# EAGLE design Control_board (EAGLE 8.6.3)
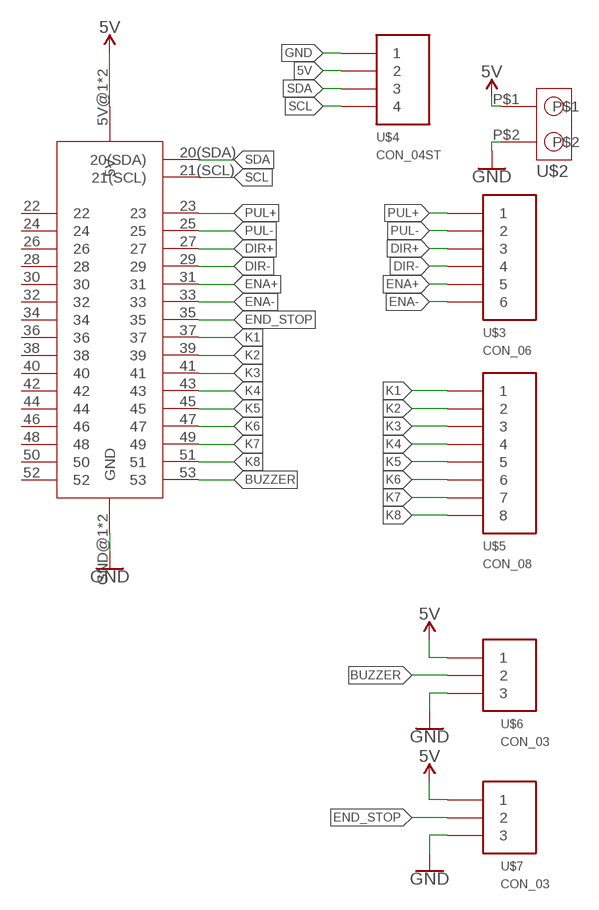
[diagram p0: schematic, sheet 1]

## Parts
U$1  ARDUINO_MEGA_SHIELD  [ARDUINO_MEGA_SHIELD]
U$2  SCREW_TERMINAL-2P  [SCREW_TERMINAL-2P]
U$3  CON_06  [6-PIN]
U$4  CON_04ST  [4-PIN]
U$5  CON_08  [8-PIN]
U$6  CON_03  [3-PIN]
U$7  CON_03  [3-PIN]

## Nets
5V: U$1.5V@1(5V) U$1.5V@2(5V) U$2.P$1 U$4.3 U$6.3 U$7.3
BUZZER: U$1.53 U$6.2
DIR+: U$1.27 U$3.3
DIR-: U$1.29 U$3.4
ENA+: U$1.31 U$3.5
ENA-: U$1.33 U$3.6
END_STOP: U$1.35 U$7.2
GND: U$1.GND@1(GND) U$1.GND@2(GND) U$2.P$2 U$4.4 U$6.1 U$7.1
K1: U$1.37 U$5.1
K2: U$1.39 U$5.2
K3: U$1.41 U$5.3
K4: U$1.43 U$5.4
K5: U$1.45 U$5.5
K6: U$1.47 U$5.6
K7: U$1.49 U$5.7
K8: U$1.51 U$5.8
PUL+: U$1.23 U$3.1
PUL-: U$1.25 U$3.2
SCL: U$1.21(SCL) U$4.1
SDA: U$1.20(SDA) U$4.2
Unconnected: U$1.22 U$1.24 U$1.26 U$1.28 U$1.30 U$1.32 U$1.34 U$1.36 U$1.38 U$1.40 U$1.42 U$1.44 U$1.46 U$1.48 U$1.50 U$1.52

## Library data of the parts
U$1 = ICD_stripper:ARDUINO_MEGA_SHIELD
U$2 = ICD_stripper:SCREW_TERMINAL-2P
U$3 = con2001_M'Lab_design_criteria:CON_06
U$4 = con2001_M'Lab_design_criteria:CON_04
U$5 = con2001_M'Lab_design_criteria:CON_08
U$6 U$7 = con2001_M'Lab_design_criteria:CON_03

## Board
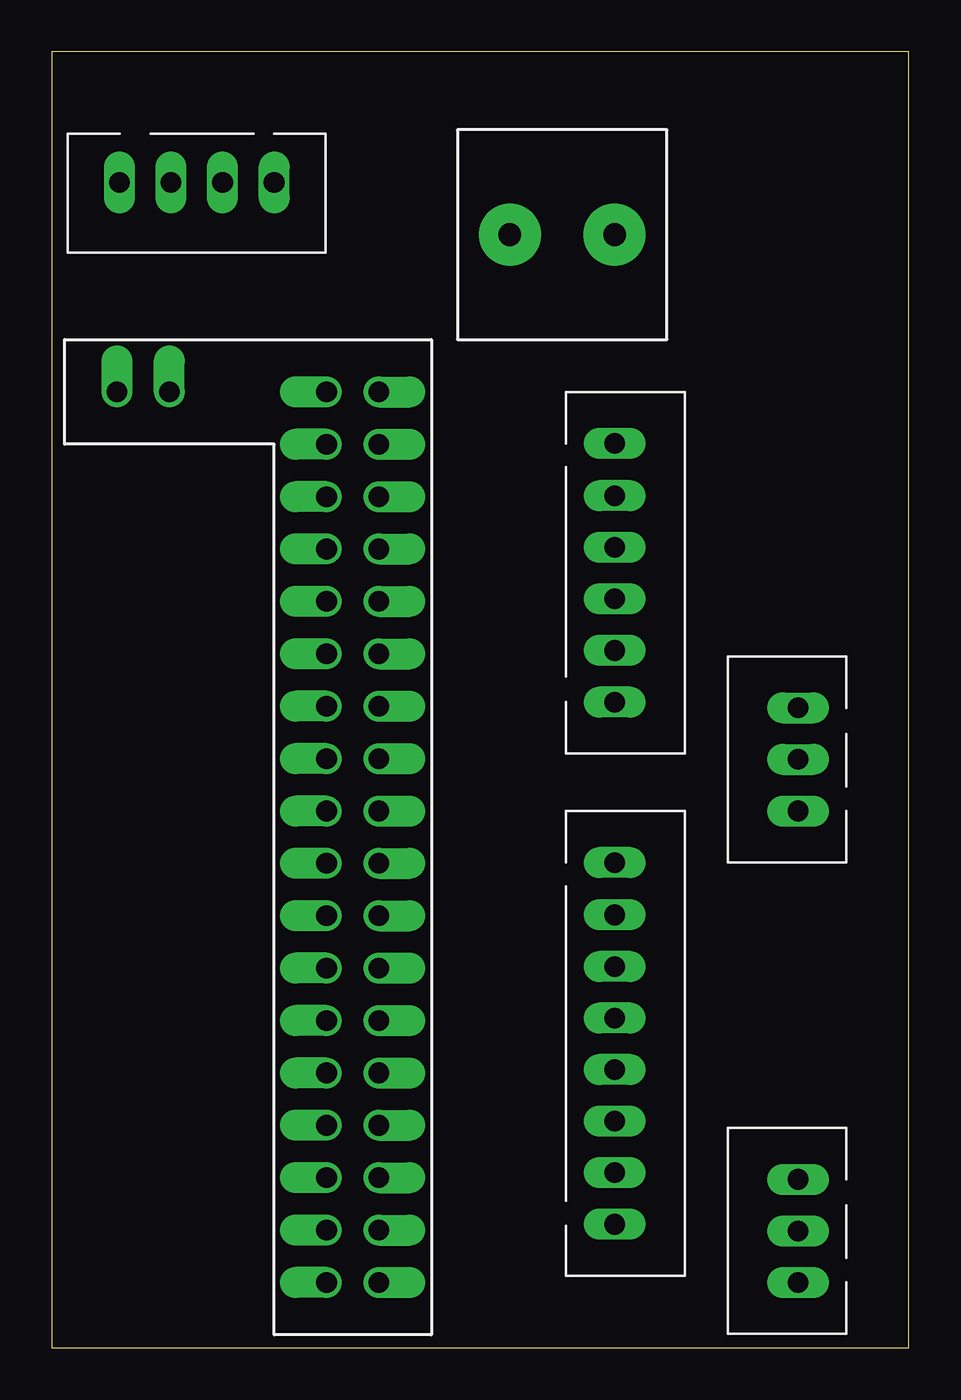
[diagram p1: board, top side]
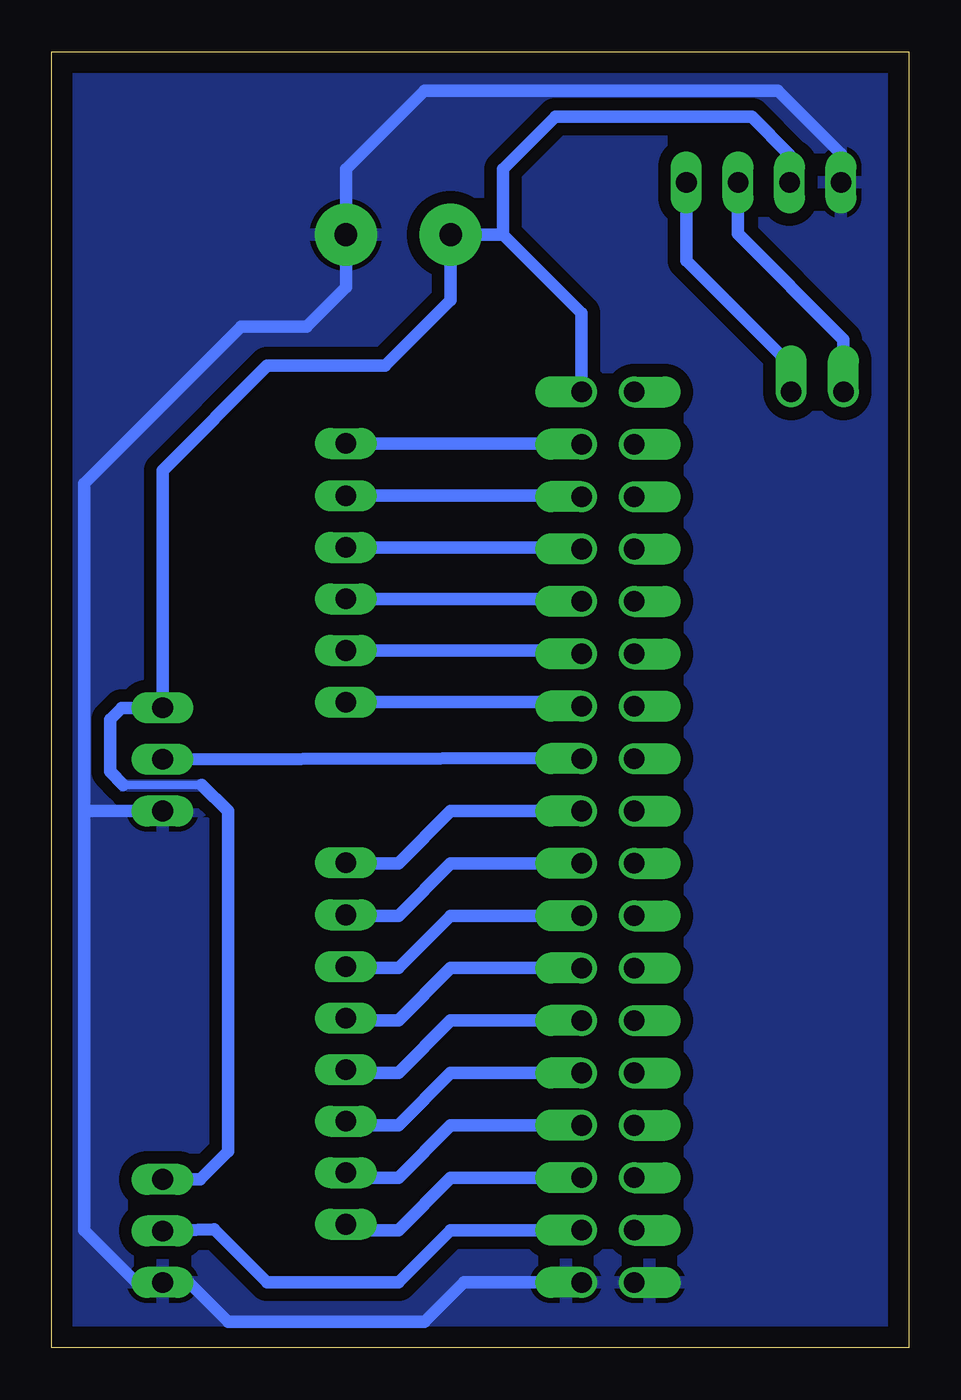
[diagram p2: board, bottom side, seen from below]

Size 41.58 x 62.85 mm. Coordinates in mm from the lower left corner, seen from the top.
Outline: 0,0 41.58,0 41.58,62.85 0,62.85 0,0
Copper layers (1*16): Top 0.035mm / dielectric 1.5mm / Bottom 0.035mm
Design rules "default": minimum track width 6mil, minimum drill 0.35mm, track to track 6mil, track to pad 6mil, pad to pad 6mil, via to via 6mil, smd to smd 6mil, copper to edge 40mil, drill to drill 6mil, minimum pad ring 10mil, minimum via ring 8mil, stop-mask expansion 4mil, vias tented up to drill 0mil, thermal gap 10mil
bRestrict: 2 lines

### Footprints (pad centres in the part's own frame; a part is rotated, then mirrored left to right if it is on the bottom)
ARDUINO_MEGA_SHIELD = drill 1 offset: 5V@1 -2.54,0; 5V@2 0,0; 20(SDA) -12.7,0; 21(SCL) -10.16,0; 22 -2.54,-2.54; 23 0,-2.54; 24 -2.54,-5.08; 25 0,-5.08; 26 -2.54,-7.62; 27 0,-7.62; 28 -2.54,-10.16; 29 0,-10.16; 30 -2.54,-12.7; 31 0,-12.7; 32 -2.54,-15.24; 33 0,-15.24; 34 -2.54,-17.78; 35 0,-17.78; 36 -2.54,-20.32; 37 0,-20.32; 38 -2.54,-22.86; 39 0,-22.86; 40 -2.54,-25.4; 41 0,-25.4; 42 -2.54,-27.94; 43 0,-27.94; 44 -2.54,-30.48; 45 0,-30.48; 46 -2.54,-33.02; 47 0,-33.02; 48 -2.54,-35.56; 49 0,-35.56; 50 -2.54,-38.1; 51 0,-38.1; 52 -2.54,-40.64; 53 0,-40.64; GND@1 -2.54,-43.18; GND@2 0,-43.18
SCREW_TERMINAL-2P = drill 1.1 pad 3: P$1 0,0; P$2 0,-5.08
6-PIN = drill 1 long: 1 -0.04,0; 2 2.5,0; 3 5,0; 4 7.5,0; 5 10,0; 6 12.5,0
4-PIN = drill 1 long: 1 0,0; 2 2.5,0; 3 5,0; 4 7.5,0
8-PIN = drill 1 long: 1 -0.04,0; 2 2.5,0; 3 5,0; 4 7.5,0; 5 10,0; 6 12.5,0; 7 15,0; 8 17.5,0
3-PIN = drill 1 long: 1 0,0; 2 2.5,0; 3 5,0

### Placement (x,y rotation side)
U$1  15.88,46.35 0 top
U$2  22.23,53.98 90 top
U$3  27.3,43.81 270 top
U$4  10.79,56.52 180 top
U$5  27.3,23.5 270 top
U$6  36.2,3.17 90 top
U$7  36.2,26.04 90 top

### Tracks (layer width: path | path; a pad name or v marks a point on that pad's centre or on a via)
5V
  Bottom 0.406: 38.1,27.3 34.29,27.3
  Bottom 0.61: 19.68,53.98 U$2.P$1 22.23,50.8 25.4,47.62 31.11,47.62 36.2,42.55 U$7.3 38.18,31.04 38.73,30.48 38.73,27.94 38.1,27.3 | 19.68,53.98 15.88,50.16 U$1.5V@2 | U$4.3 5.79,57.87 7.62,59.69 17.14,59.69 19.68,57.15 19.68,53.98 | 34.29,27.3 33.02,26.04 33.02,9.53 34.37,8.18 U$6.3
  pour Bottom: 34.29,27.69 34.29,26.92 38.1,26.92 38.1,27.69
BUZZER
  Bottom 0.61: U$1.53 22.23,5.71 24.77,3.17 31.11,3.17 33.7,5.75 U$6.2
DIR+
  Bottom 0.61: U$1.27 15.96,38.81 U$3.3
DIR-
  Bottom 0.61: U$1.29 15.99,36.31 U$3.4
ENA+
  Bottom 0.61: U$1.31 16.04,33.81 U$3.5
ENA-
  Bottom 0.61: U$1.33 16.07,31.32 U$3.6
END_STOP
  Bottom 0.61: U$1.35 15.91,28.61 U$7.2
GND
  Bottom 0.61: U$1.GND@2 21.59,3.17 23.5,1.27 33.02,1.27 34.92,3.17 U$6.1 37.47,3.17 40.01,5.71 40.01,26.04 | U$4.4 3.29,57.91 6.35,60.96 23.5,60.96 27.3,57.15 U$2.P$2 27.3,51.44 29.21,49.53 32.38,49.53 40.01,41.91 40.01,26.04 | U$7.1 40.01,26.04
  pour Bottom (isolate 0.61): 0,0 0,62.87 41.27,62.87 41.27,0
K1
  Bottom 0.61: U$1.37 22.23,26.04 24.77,23.5 27.27,23.5 U$5.1
K2
  Bottom 0.61: U$1.39 22.23,23.5 24.77,20.95 27.27,20.95 U$5.2
K3
  Bottom 0.61: U$1.41 22.23,20.95 24.77,18.41 27.23,18.41 U$5.3
K4
  Bottom 0.61: U$1.43 22.23,18.41 24.77,15.88 27.18,15.88 U$5.4
K5
  Bottom 0.61: U$1.45 22.23,15.88 24.77,13.34 27.14,13.34 U$5.5
K6
  Bottom 0.61: U$1.47 22.23,13.34 24.77,10.79 27.11,10.79 U$5.6
K7
  Bottom 0.61: U$1.49 22.23,10.79 24.77,8.26 27.07,8.26 U$5.7
K8
  Bottom 0.61: U$1.51 22.23,8.26 24.77,5.71 27.02,5.71 U$5.8
N$1
  pour Bottom: 1.27,20.32 9.53,20.32 9.53,1.27 1.27,1.27
PUL+
  Bottom 0.61: U$1.23 15.91,43.85 U$3.1
PUL-
  Bottom 0.61: U$1.25 15.91,41.31 U$3.2
SCL
  Bottom 0.61: U$4.1 10.79,52.7 5.71,47.62 U$1.21(SCL)
SDA
  Bottom 0.61: U$4.2 8.29,54.02 3.17,48.9 U$1.20(SDA)

### Text on the board
bRestrict: M Lab